# Altium schematic sheet Ethernet.SchDoc
size E
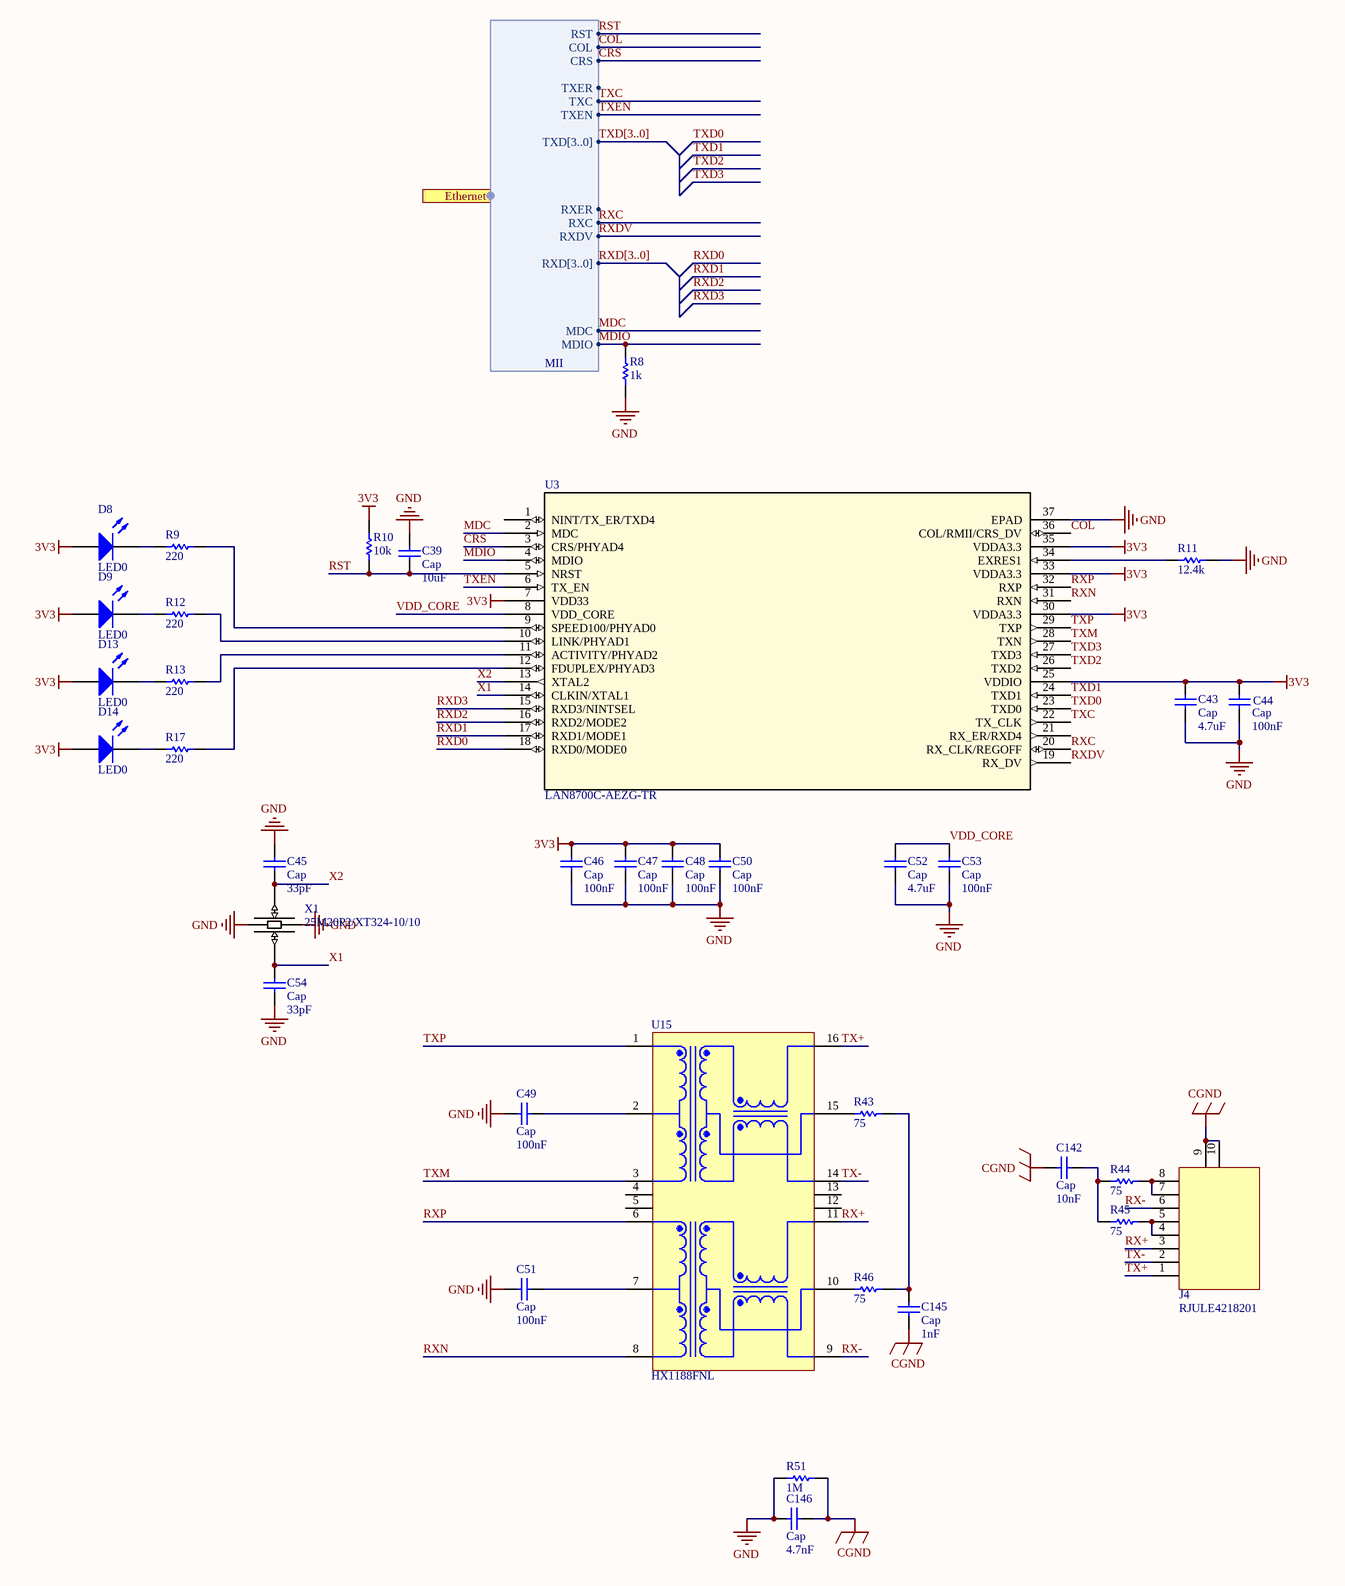
[diagram p0: Ethernet.SchDoc]

## Parts
C39  Cap  value 10uF  [6-0805_M]
C43  Cap  value 4.7uF  [1608[0603]]
C44  Cap  value 100nF  [0402-A]
C45  Cap  value 33pF  [0402-A]
C46  Cap  value 100nF  [0402-A]
C47  Cap  value 100nF  [0402-A]
C48  Cap  value 100nF  [0402-A]
C49  Cap  value 100nF  [1608[0603]]
C50  Cap  value 100nF  [0402-A]
C51  Cap  value 100nF  [1608[0603]]
C52  Cap  value 4.7uF  [1608[0603]]
C53  Cap  value 100nF  [0402-A]
C54  Cap  value 33pF  [0402-A]
C142  Cap  value 10nF  [0402-A]
C145  Cap  value 1nF  [0402-A]
C146  Cap  value 4.7nF  [C1206]
D8  LED0  [1608[0603]]
D9  LED0  [1608[0603]]
D13  LED0  [1608[0603]]
D14  LED0  [1608[0603]]
J4  RJULE4218201  [RJULE4218201]
R8  value 1k  [0402-A]  (hidden comment: Res1)
R9  value 220  [0402-A]  (hidden comment: Res1)
R10  value 10k  [0402-A]  (hidden comment: Res1)
R11  value 12.4k  [0402-A]  (hidden comment: Res1)
R12  value 220  [0402-A]  (hidden comment: Res1)
R13  value 220  [0402-A]  (hidden comment: Res1)
R17  value 220  [0402-A]  (hidden comment: Res1)
R43  value 75  [0402-A]  (hidden comment: Res1)
R44  value 75  [0402-A]  (hidden comment: Res1)
R45  value 75  [0402-A]  (hidden comment: Res1)
R46  value 75  [0402-A]  (hidden comment: Res1)
R51  value 1M  [C1206]  (hidden comment: Res1)
U3  LAN8700C-AEZG-TR  [QFN36_6X6MC_MCH]
U15  HX1188FNL  [PULS-HX1188FNL-SMT-16_V]
X1  25M20P2/XT324-10/10  [25M20P2/XT324-10/10]

## Ports
Ethernet (harness MII)

## Harnesses
MII: MDIO, MDC, RXD[3..0], TXD[3..0], RXDV, RXC, RXER, TXEN, TXC, TXER, CRS, COL, RST

## Nets
3V3: C43.1 C44.1 C46.1 C47.1 C48.1 C50.1 D8.1(A) D9.1(A) D13.1(A) D14.1(A) R10.1 U3.7(VDD33) U3.25(VDDIO) U3.30(VDDA3.3) U3.33(VDDA3.3) U3.35(VDDA3.3)
CGND: C142.2 C145.2 C146.2 J4.9 J4.10 R51.1
GND: C39.1 C43.2 C44.2 C45.2 C46.2 C47.2 C48.2 C49.2 C50.2 C51.2 C52.2 C53.2 C54.1 C146.1 R8.2 R11.1 R51.2 U3.37(EPAD) X1.2 X1.4
COL: U3.36(COL/RMII/CRS_DV) ; port Ethernet.COL
CRS: U3.3(CRS/PHYAD4) ; port Ethernet.CRS
MDC: U3.2(MDC) ; port Ethernet.MDC
MDIO: R8.1 U3.4(MDIO) ; port Ethernet.MDIO
RST: C39.2 R10.2 U3.5(NRST) ; port Ethernet.RST
RX+: J4.3 U15.11(RX+)
RX-: J4.6 U15.9(RX-)
RXC: U3.20(RX_CLK/REGOFF) ; port Ethernet.RXC
RXD0: U3.18(RXD0/MODE0)
RXD1: U3.17(RXD1/MODE1)
RXD2: U3.16(RXD2/MODE2)
RXD3: U3.15(RXD3/NINTSEL)
RXDV: U3.19(RX_DV) ; port Ethernet.RXDV
RXN: U3.31(RXN) U15.8(RD-)
RXP: U3.32(RXP) U15.6(RD+)
TX+: J4.1 U15.16(TX+)
TX-: J4.2 U15.14(TX-)
TXC: U3.22(TX_CLK) ; port Ethernet.TXC
TXD0: U3.23(TXD0)
TXD1: U3.24(TXD1)
TXD2: U3.26(TXD2)
TXD3: U3.27(TXD3)
TXEN: U3.6(TX_EN) ; port Ethernet.TXEN
TXM: U3.28(TXN) U15.3(TD-)
TXP: U3.29(TXP) U15.1(TD+)
VDD_CORE: C52.1 C53.1 U3.8(VDD_CORE)
X1: C54.2 U3.14(CLKIN/XTAL1) X1.1
X2: C45.1 U3.13(XTAL2) X1.3
NetC49_1: C49.1 U15.2(TCT)
NetC51_1: C51.1 U15.7(RCT)
NetC142_1: C142.1 R44.2 R45.2
NetC145_1: C145.1 R43.1 R46.1
NetD8_2: D8.2(K) R9.1
NetD9_2: D9.2(K) R12.1
NetD13_2: D13.2(K) R13.1
NetD14_2: D14.2(K) R17.1
NetJ4_4: J4.4 J4.5 R45.1
NetJ4_7: J4.7 J4.8 R44.1
NetR9_2: R9.2 U3.9(SPEED100/PHYAD0)
NetR11_2: R11.2 U3.34(EXRES1)
NetR12_2: R12.2 U3.10(LINK/PHYAD1)
NetR13_2: R13.2 U3.11(ACTIVITY/PHYAD2)
NetR17_2: R17.2 U3.12(FDUPLEX/PHYAD3)
NetR43_2: R43.2 U15.15(CMT)
NetR46_2: R46.2 U15.10(CMT)

Not connected (* = marked no-connect by the designer): U3 1(NINT/TX_ER/TXD4) 21(RX_ER/RXD4); U15 4(NC) 5(NC) 12(NC) 13(NC)

## Buses and harness runs
bus RXD[3..0]
bus TXD[3..0]

## Library data of the parts
C39 C43-C54 C142 C145 C146 = Cap: Capacitor; Published: 8-Jun-2000; LatestRevisionDate: 17-Jul-2002; LatestRevisionNote: Re-released for DXP Platform.; PackageReference: RAD-0.3; Publisher: Altium Limited; PackageDescription: Radial Cap, Thru-Hole; 2 Leads; 0.3 in Pin Spacing
  C39 C43-C48 C50-C54 C142: Supplier 1: Digi-Key; Supplier Part Number 1: 490-3295-1-ND
R8-R13 R17 R43-R46 R51 = Res1: Resistor; Published: 8-Jun-2000; LatestRevisionDate: 17-Jul-2002; LatestRevisionNote: Re-released for DXP Platform.; PackageReference: AXIAL-0.3; Publisher: Altium Limited; PackageDescription: Axial Device, Thru-Hole; 2 Leads; 0.3 in Pin Spacing
U3 = LAN8700C-AEZG-TR: No Description Available; Mfr_Name: Microchip; Copyright: Copyright (C) 2021 Ultra Librarian. All rights reserved.; Manufacturer_Part_Number: LAN8700C-AEZG-TR; Digi-Key_Part_Number_1: LAN8700C-AEZG-CT-ND; Digi-Key_Part_Number_2: LAN8700C-AEZG-DKR-ND; Digi-Key_Part_Number_3: LAN8700C-AEZG-TR-ND; RefDes: RefDes; Type: DEV
U15 = CMP-2000-06431-1: Telecom Transformer 1:1/1:1, -40 to 85 degC, 16-Pin SMT, RoHS, Tube; Manufacturer: Pulse Electronics; Turns Ratio - Primary: Secondary:1:1Transmitter,1:1Receiver; Online Catalog: HX1188; Other Names: 553-2200; Other Related Documents: PackagesFNLvs.NL; Transformer Type: IsolationandDataInterface(Encapsulated); Datasheet Version: Rev. B, 05/2014; Family: PulseTransformers; PartNumber: HX1188FNL; Manufacturer URL: http://www.pulseelectronics.com/; Package Description: 16-Pin Surface Mount Device, Body 12.7 x 9.09 mm, Pitch 1.27 mm; Mounting Type: SurfaceMount; Package Reference: SMT; Mounting Technology: SurfaceMount; Datasheet URL: http://productfinder.pulseeng.com/products/datasheets/HX1188FNL.pdf;jsessionid=D0CB5525A348FF42F5E5BE320CB10324; Height - Seated (Max): 5.99mm; Category: Transformers; Standard Package: 40; Size / Dimension: 12.70mmLx9.00mmW
D8 D9 D13 D14 = LED0: Published: 8-Jun-2000; LatestRevisionDate: 08-Jul-2005; LatestRevisionNote: Mech Layer 1 removed.; PackageReference: LED-0; Publisher: Altium Limited; PackageDescription: LED; 2 Leads